# Altium project EtherWiz_3K4KNic.PrjPcb
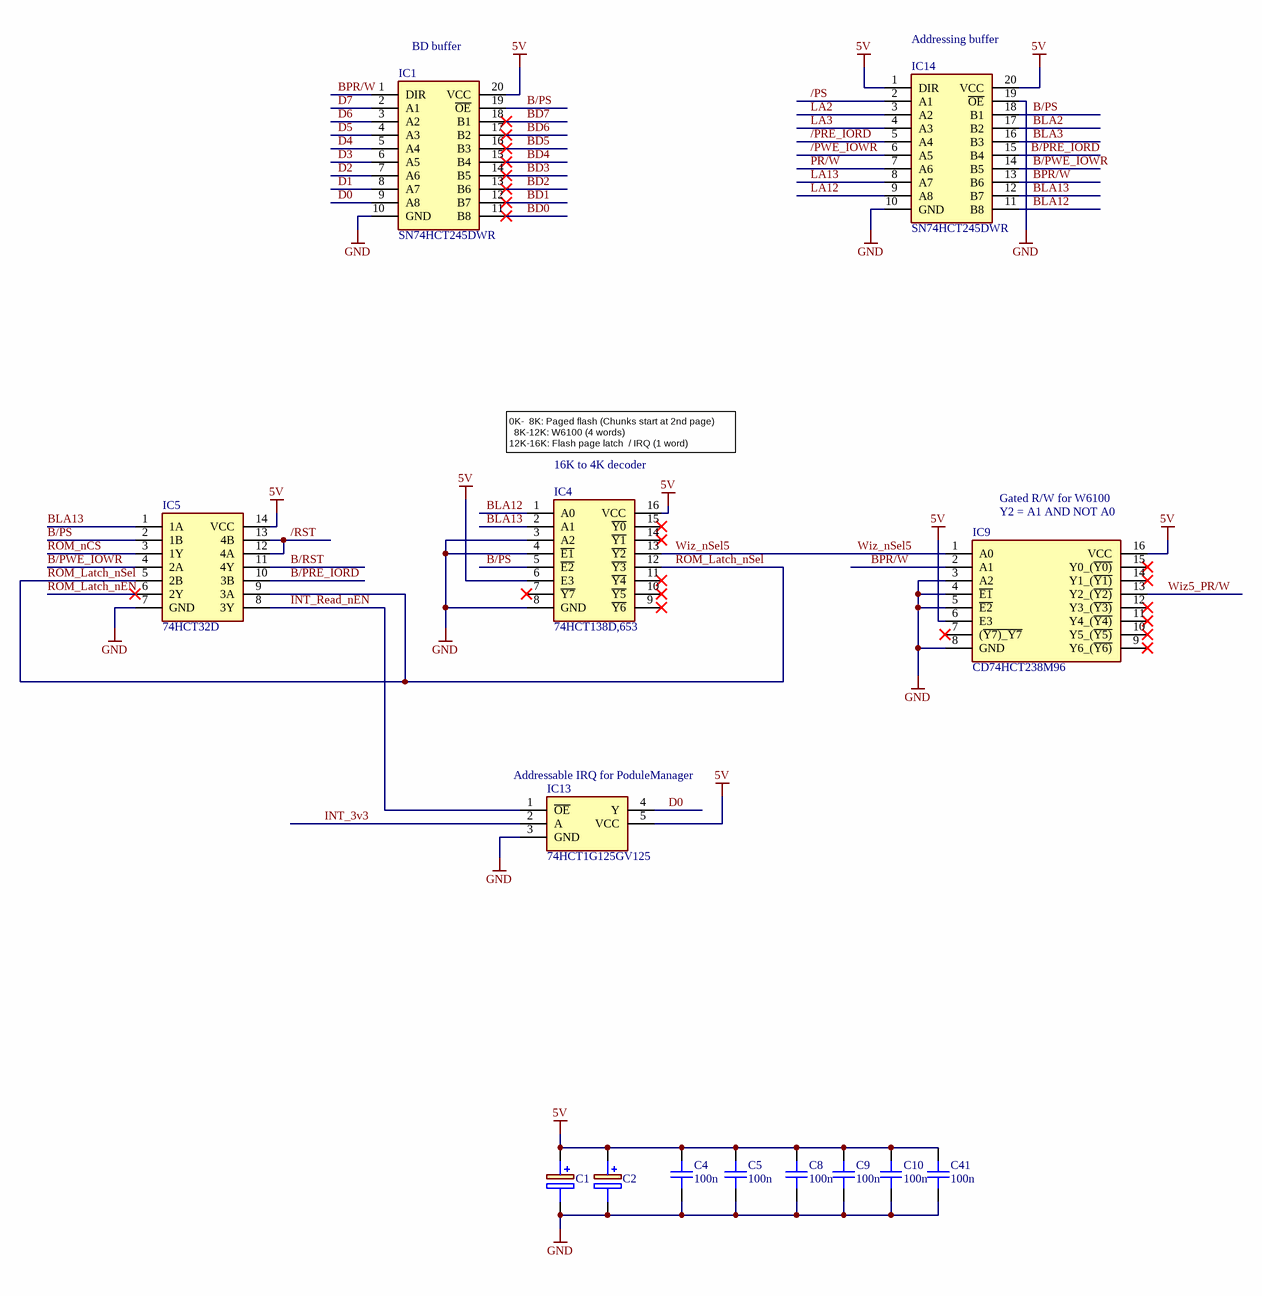
[diagram p0: EtherWiz.SchDoc]
DrawnBy: Ian Jeffray; PCB_RevNo: 1.1; Project_Title: EtherWiz; Sch_ReleaseDate: October 2026; Sch_RevNo: 7
4 sheets, 76 parts. Net scope: global (net labels, ports and power ports of the same name join across sheets).
Board file: EtherWiz_3K4KNic.PcbDoc
Sheets:
  EtherWiz.SchDoc
  EtherWiz_3K4KNic.SchDoc
  EtherWiz_Controller.SchDoc
  EtherWiz_ROM.SchDoc

## Sheet EtherWiz.SchDoc
size A3; SheetNumber: 1; SheetTotal: 3

### Parts
C1  EEE-HA1C470AP  [EEE1AA101SP]  (value not drawn)
C2  EEE-HA1C470AP  [EEE1AA101SP]  (value not drawn)
C4  100n  [CAPC1608L]
C5  100n  [CAPC1608L]
C8  100n  [CAPC1608L]
C9  100n  [CAPC1608L]
C10  100n  [CAPC1608L]
C41  100n  [CAPC1608L]
IC1  SN74HCT245DWR  [SOIC127P1030X265-20N]
IC4  74HCT138D,653  [SOIC127P600X175-16N]
IC5  74HCT32D  [SOIC127P600X175-14N]
IC9  CD74HCT238M96  [SOIC127P600X175-16N]
IC13  74HCT1G125GV125  [SOT95P275X110-5N]
IC14  SN74HCT245DWR  [SOIC127P1030X265-20N]

### Nets
5V: C1.1(+) C2.1(+) C4.2 C5.2 C8.2 C9.2 C10.2 C41.2 IC1.20(VCC) IC4.6(E3) IC4.16(VCC) IC5.14(VCC) IC9.6(E3) IC9.16(VCC) IC13.5(VCC) IC14.1(DIR) IC14.20(VCC)
GND: C1.2(-) C2.2(-) C4.1 C5.1 C8.1 C9.1 C10.1 C41.1 IC1.10(GND) IC4.3(A2) IC4.4(~{E1}) IC4.8(GND) IC5.7(GND) IC9.3(A2) IC9.4(~{E1}) IC9.5(~{E2}) IC9.8(GND) IC13.3(GND) IC14.10(GND) IC14.19(~{OE})
/PRE_IORD: IC14.5(A4)
/PS: IC14.2(A1)
/PWE_IOWR: IC14.6(A5)
/RST: IC5.12(4A) IC5.13(4B)
B/PRE_IORD: IC5.10(3B) IC14.15(B4)
B/PS: IC1.19(~{OE}) IC4.5(~{E2}) IC5.2(1B) IC14.18(B1)
B/PWE_IOWR: IC5.4(2A) IC14.14(B5)
B/RST: IC5.11(4Y)
BD0: IC1.11(B8)
BD1: IC1.12(B7)
BD2: IC1.13(B6)
BD3: IC1.14(B5)
BD4: IC1.15(B4)
BD5: IC1.16(B3)
BD6: IC1.17(B2)
BD7: IC1.18(B1)
BLA2: IC14.17(B2)
BLA3: IC14.16(B3)
BLA12: IC4.1(A0) IC14.11(B8)
BLA13: IC4.2(A1) IC5.1(1A) IC14.12(B7)
BPR/W: IC1.1(DIR) IC9.2(A1) IC14.13(B6)
D0: IC1.9(A8) IC13.4(Y)
D1: IC1.8(A7)
D2: IC1.7(A6)
D3: IC1.6(A5)
D4: IC1.5(A4)
D5: IC1.4(A3)
D6: IC1.3(A2)
D7: IC1.2(A1)
INT_3v3: IC13.2(A)
INT_Read_nEN: IC5.8(3Y) IC13.1(~{OE})
LA2: IC14.3(A2)
LA3: IC14.4(A3)
LA12: IC14.9(A8)
LA13: IC14.8(A7)
PR/W: IC14.7(A6)
ROM_Latch_nEN: IC5.6(2Y)
ROM_Latch_nSel: IC4.12(~{Y3}) IC5.5(2B) IC5.9(3A)
ROM_nCS: IC5.3(1Y)
Wiz5_PR/W: IC9.13(Y2_(~{Y2)})
Wiz_nSel5: IC4.13(~{Y2}) IC9.1(A0)

Not connected (* = marked no-connect by the designer): IC4 7(~{Y7})* 9(~{Y6})* 10(~{Y5})* 11(~{Y4})* 14(~{Y1})* 15(~{Y0})*; IC9 7((~{Y7)_Y7})* 9(Y6_(~{Y6)})* 10(Y5_(~{Y5)})* 11(Y4_(~{Y4)})* 12(Y3_(~{Y3)})* 14(Y1_(~{Y1)})* 15(Y0_(~{Y0)})*

### Notes on the sheet
- (near IC1) BD buffer
- (near IC14) Addressing buffer
- 0K-  8K: Paged flash (Chunks start at 2nd page)
  8K-12K: W6100 (4 words)
  12K-16K: Flash page latch  / IRQ (1 word)
- (near IC4) 16K to 4K decoder
- (near IC9) Gated R/W for W6100
- (near IC9) Y2 = A1 AND NOT A0
- (near IC13) Addressable IRQ for PoduleManager
- SIZE
- DIMENSIONS
- TITLE
- VARIANT
- REVISION
- DATE
- A3
- SHEET
- OF
- FILE
- DRAWN BY

### Library data of the parts
C1 C2 = EEE-HA1C470AP: Capacitor Polarised; Manufacturer_Name: Panasonic; Datasheet Link: http://industrial.panasonic.com/cdbs/www-data/pdf/RDE0000/ABA0000C1148.pdf; Height: 7.8mm; Manufacturer_Part_Number: EEE-HA1C470AP; Mouser Part Number: 667-EEE-HA1C470AP; Mouser Price/Stock: https://www.mouser.co.uk/ProductDetail/Panasonic/EEE-HA1C470AP?qs=d1CqaRUMZD%2FL5qU1hDRerg%3D%3D; Arrow Part Number: EEE-HA1C470AP; Arrow Price/Stock: https://www.arrow.com/en/products/eeeha1c470ap/panasonic?utm_currency=USD&region=europe
C4 C5 C8-C10 C41 = CAP_100n_0603_50V_0: CAP 100nF, 0603, 50V, X7R, 10%; Manufacturer1: Samsung; ManuPart1: CL10B104KB8NNNC; ManuPart2: CC0603KRX7R9BB104; Value: 100n; Distributor1: Anglia; Manufacturer2: Yageo; Distributor2: Digikey; Distributor1 Part No: CL10B104KB8NNNC; Distributor2 Part No: 311-1344-2-ND; ComponentLinknURL: *; ComponentLink1Description: ComponentLinknURL1; ComponentLink1URL: https://media.digikey.com/pdf/Data%20Sheets/Samsung%20PDFs/CL_Series_MLCC_ds.pdf; ComponentLink2Description: ComponentLinknURL2; ComponentLink2URL: https://www.yageo.com/upload/media/product/productsearch/datasheet/mlcc/UPY-GPHC_X7R_6.3V-to-50V_18.pdf; Voltage: 50V
IC1 IC14 = SN74HCT245DWR: Integrated Circuit; Manufacturer_Name: Texas Instruments; Datasheet Link: https://datasheet.datasheetarchive.com/originals/distributors/SFDatasheet-6/sf-000131457.pdf; Height: 2.65mm; Manufacturer_Part_Number: SN74HCT245DWR; Mouser Part Number: 595-SN74HCT245DWR; Mouser Price/Stock: https://www.mouser.co.uk/ProductDetail/Texas-Instruments/SN74HCT245DWR?qs=st7IWvlL5%2FhHLMwvvkYTgw%3D%3D; Arrow Part Number: SN74HCT245DWR; Arrow Price/Stock: https://www.arrow.com/en/products/sn74hct245dwr/texas-instruments?region=nac
IC4 = 74HCT138D,653: Integrated Circuit; Manufacturer_Name: Nexperia; Datasheet Link: https://assets.nexperia.com/documents/data-sheet/74HC_HCT138.pdf; Height: 1.75mm; Manufacturer_Part_Number: 74HCT138D,653; Mouser Part Number: 771-74HCT138D-T; Mouser Price/Stock: https://www.mouser.co.uk/ProductDetail/Nexperia/74HCT138D653?qs=P62ublwmbi8MKahyK7iY6g%3D%3D; Arrow Part Number: 74HCT138D,653; Arrow Price/Stock: https://www.arrow.com/en/products/74hct138d653/nexperia?region=nac
IC5 = 74HCT32D: Integrated Circuit; Manufacturer_Name: Toshiba; Datasheet Link: https://toshiba.semicon-storage.com/info/docget.jsp?did=37176&prodName=74HCT32D; Height: 1.75mm; Manufacturer_Part_Number: 74HCT32D; Mouser Part Number: N/A; Mouser Price/Stock: https://www.mouser.co.uk/ProductDetail/Toshiba/74HCT32D?qs=j%252B1pi9TdxUZqVZos7uP1Yw%3D%3D; Arrow Part Number: 74HCT32D; Arrow Price/Stock: https://www.arrow.com/en/products/74hct32d/toshiba?region=nac
IC9 = CD74HCT238M96: Integrated Circuit; Manufacturer_Name: Texas Instruments; Datasheet Link: http://www.ti.com/lit/gpn/cd74hct238; Height: 1.75mm; Manufacturer_Part_Number: CD74HCT238M96; Mouser Part Number: 595-CD74HCT238M96; Mouser Price/Stock: https://www.mouser.co.uk/ProductDetail/Texas-Instruments/CD74HCT238M96?qs=xFfolx0DHx1u%2Fks4%2FbIqqQ%3D%3D
IC13 = 74HCT1G125GV125: Integrated Circuit; Manufacturer_Name: Nexperia; Datasheet Link: https://assets.nexperia.com/documents/data-sheet/74HC_HCT1G125.pdf; Height: 1.1mm; Manufacturer_Part_Number: 74HCT1G125GV125

## Sheet EtherWiz_3K4KNic.SchDoc
size A3; SheetNumber: 2; SheetTotal: 3
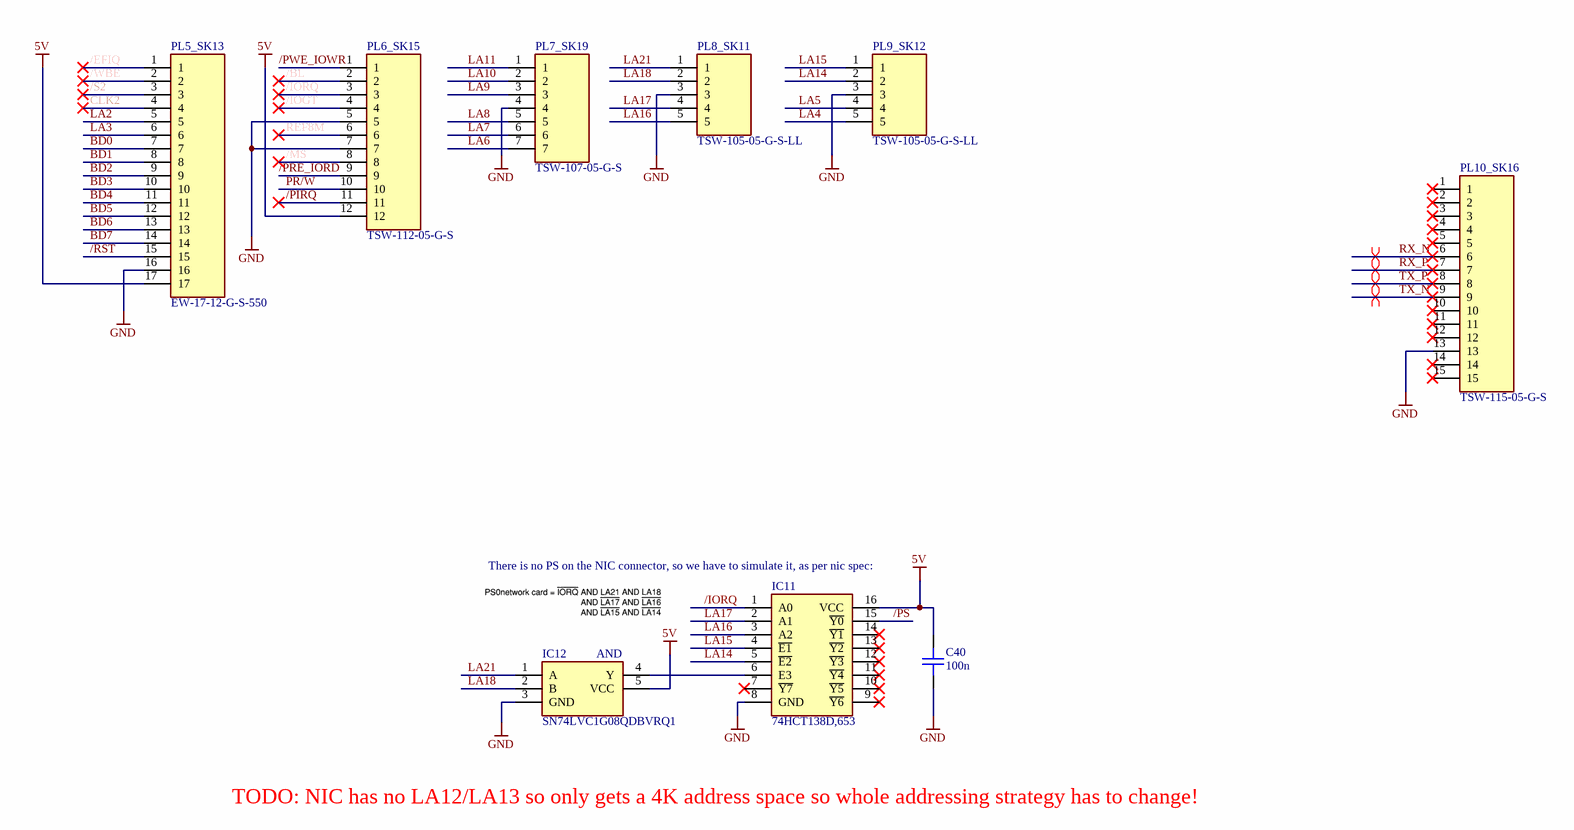
[diagram p1: EtherWiz_3K4KNic.SchDoc]

### Parts
C40  100n  [CAPC1608L]
IC11  74HCT138D,653  [SOIC127P600X175-16N]
IC12  SN74LVC1G08QDBVRQ1  [SOT95P280X145-5N]
PL5_SK13  EW-17-12-G-S-550  [TSW-117-XX-YY-S]
PL6_SK15  TSW-112-05-G-S  [TSW-112-XX-YY-S]
PL7_SK19  TSW-107-05-G-S  [TSW-107-XX-YY-S]
PL8_SK11  TSW-105-05-G-S-LL  [HDRV5W64P0X254_1X5_1270X254X521P]
PL9_SK12  TSW-105-05-G-S-LL  [HDRV5W64P0X254_1X5_1270X254X521P]
PL10_SK16  TSW-115-05-G-S  [TSW-115-XX-YY-S]

### Nets
5V: C40.2 IC11.16(VCC) IC12.5(VCC) PL5_SK13.17 PL6_SK15.12
GND: C40.1 IC11.8(GND) IC12.3(GND) PL5_SK13.16 PL6_SK15.5 PL6_SK15.7 PL7_SK19.4 PL8_SK11.3 PL9_SK12.3 PL10_SK16.13
/BL: PL6_SK15.2
/EFIQ: PL5_SK13.1
/IOGT: PL6_SK15.4
/IORQ: IC11.1(A0) PL6_SK15.3
/MS: PL6_SK15.8
/PIRQ: PL6_SK15.11
/PRE_IORD: PL6_SK15.9
/PS: IC11.15(~{Y0})
/PWE_IOWR: PL6_SK15.1
/RST: PL5_SK13.15
/S2: PL5_SK13.3
/WBE: PL5_SK13.2
BD0: PL5_SK13.7
BD1: PL5_SK13.8
BD2: PL5_SK13.9
BD3: PL5_SK13.10
BD4: PL5_SK13.11
BD5: PL5_SK13.12
BD6: PL5_SK13.13
BD7: PL5_SK13.14
CLK2: PL5_SK13.4
LA2: PL5_SK13.5
LA3: PL5_SK13.6
LA4: PL9_SK12.5
LA5: PL9_SK12.4
LA6: PL7_SK19.7
LA7: PL7_SK19.6
LA8: PL7_SK19.5
LA9: PL7_SK19.3
LA10: PL7_SK19.2
LA11: PL7_SK19.1
LA14: IC11.5(~{E2}) PL9_SK12.2
LA15: IC11.4(~{E1}) PL9_SK12.1
LA16: IC11.3(A2) PL8_SK11.5
LA17: IC11.2(A1) PL8_SK11.4
LA18: IC12.2(B) PL8_SK11.2
LA21: IC12.1(A) PL8_SK11.1
PR/W: PL6_SK15.10
REF8M: PL6_SK15.6
RX_N: PL10_SK16.6
RX_P: PL10_SK16.7
TX_N: PL10_SK16.9
TX_P: PL10_SK16.8
NetIC11_6: IC11.6(E3) IC12.4(Y)

Not connected (* = marked no-connect by the designer): IC11 7(~{Y7})* 9(~{Y6})* 10(~{Y5})* 11(~{Y4})* 12(~{Y3})* 13(~{Y2})* 14(~{Y1})*; PL10_SK16 1* 2* 3* 4* 5* 10* 11* 12* 14* 15*

### Layout directives
differential pair: RX_N, RX_P, TX_N, TX_P

### Notes on the sheet
- (near IC11) There is no PS on the NIC connector, so we have to simulate it, as per nic spec:
- (near IC12) AND
- TODO: NIC has no LA12/LA13 so only gets a 4K address space so whole addressing strategy has to change!
- SIZE
- DIMENSIONS
- TITLE
- VARIANT
- REVISION
- DATE
- A3
- SHEET
- OF
- FILE
- DRAWN BY

### Library data of the parts
C40 = CAP_100n_0603_50V_0: as C4 on sheet EtherWiz; Value: 100n; Distributor1: Anglia; Manufacturer2: Yageo; Distributor2: Digikey; Distributor1 Part No: CL10B104KB8NNNC; Distributor2 Part No: 311-1344-2-ND; ComponentLinknURL: *; ComponentLink1Description: ComponentLinknURL1; ComponentLink1URL: https://media.digikey.com/pdf/Data%20Sheets/Samsung%20PDFs/CL_Series_MLCC_ds.pdf; ComponentLink2Description: ComponentLinknURL2; ComponentLink2URL: https://www.yageo.com/upload/media/product/productsearch/datasheet/mlcc/UPY-GPHC_X7R_6.3V-to-50V_18.pdf; Voltage: 50V
IC11 = 74HCT138D,653: as IC4 on sheet EtherWiz; Datasheet Link: https://assets.nexperia.com/documents/data-sheet/74HC_HCT138.pdf; Height: 1.75mm; Manufacturer_Part_Number: 74HCT138D,653; Mouser Part Number: 771-74HCT138D-T; Mouser Price/Stock: https://www.mouser.co.uk/ProductDetail/Nexperia/74HCT138D653?qs=P62ublwmbi8MKahyK7iY6g%3D%3D; Arrow Part Number: 74HCT138D,653; Arrow Price/Stock: https://www.arrow.com/en/products/74hct138d653/nexperia?region=nac
IC12 = SN74LVC1G08QDBVRQ1: Integrated Circuit; Manufacturer_Name: Texas Instruments; Datasheet Link: http://www.ti.com/lit/ds/symlink/sn74lvc1g08-q1.pdf; Height: 1.45mm; Manufacturer_Part_Number: SN74LVC1G08QDBVRQ1; Mouser Part Number: 595-SN74LVC1G08QDBQ1; Mouser Price/Stock: https://www.mouser.co.uk/ProductDetail/Texas-Instruments/SN74LVC1G08QDBVRQ1?qs=PVVDbbWpW3K%252BPBrUmLG6eg%3D%3D; Arrow Part Number: SN74LVC1G08QDBVRQ1; Arrow Price/Stock: https://www.arrow.com/en/products/sn74lvc1g08qdbvrq1/texas-instruments?utm_currency=USD&region=nac
PL5_SK13 = TSW-117-05-G-S: Connector; Manufacturer_Name: SAMTEC; Datasheet Link: http://suddendocs.samtec.com/prints/tsw-xxx-xx-xxx-x-xx-xxx-mkt.pdf; Manufacturer_Part_Number: TSW-117-05-G-S
PL6_SK15 = TSW-112-05-G-S: Connector; Manufacturer_Name: SAMTEC; Datasheet Link: http://suddendocs.samtec.com/prints/tsw-xxx-xx-xxx-x-xx-xxx-mkt.pdf; Manufacturer_Part_Number: TSW-112-05-G-S
PL7_SK19 = TSW-107-05-G-S: Connector; Manufacturer_Name: SAMTEC; Datasheet Link: http://suddendocs.samtec.com/prints/tsw-xxx-xx-xxx-x-xx-xxx-mkt.pdf; Manufacturer_Part_Number: TSW-107-05-G-S
PL8_SK11 PL9_SK12 = TSW-105-05-G-S-LL: Connector; Manufacturer_Name: SAMTEC; Datasheet Link: https://componentsearchengine.com/Datasheets/2/TSW-105-05-G-S-LL.pdf; Height: 5.21mm; Manufacturer_Part_Number: TSW-105-05-G-S-LL
PL10_SK16 = TSW-115-05-G-S: Connector; Manufacturer_Name: SAMTEC; Datasheet Link: http://suddendocs.samtec.com/prints/tsw-xxx-xx-xxx-x-xx-xxx-mkt.pdf; Manufacturer_Part_Number: TSW-115-05-G-S

## Sheet EtherWiz_Controller.SchDoc
size A3; SheetNumber: 2; SheetTotal: 3
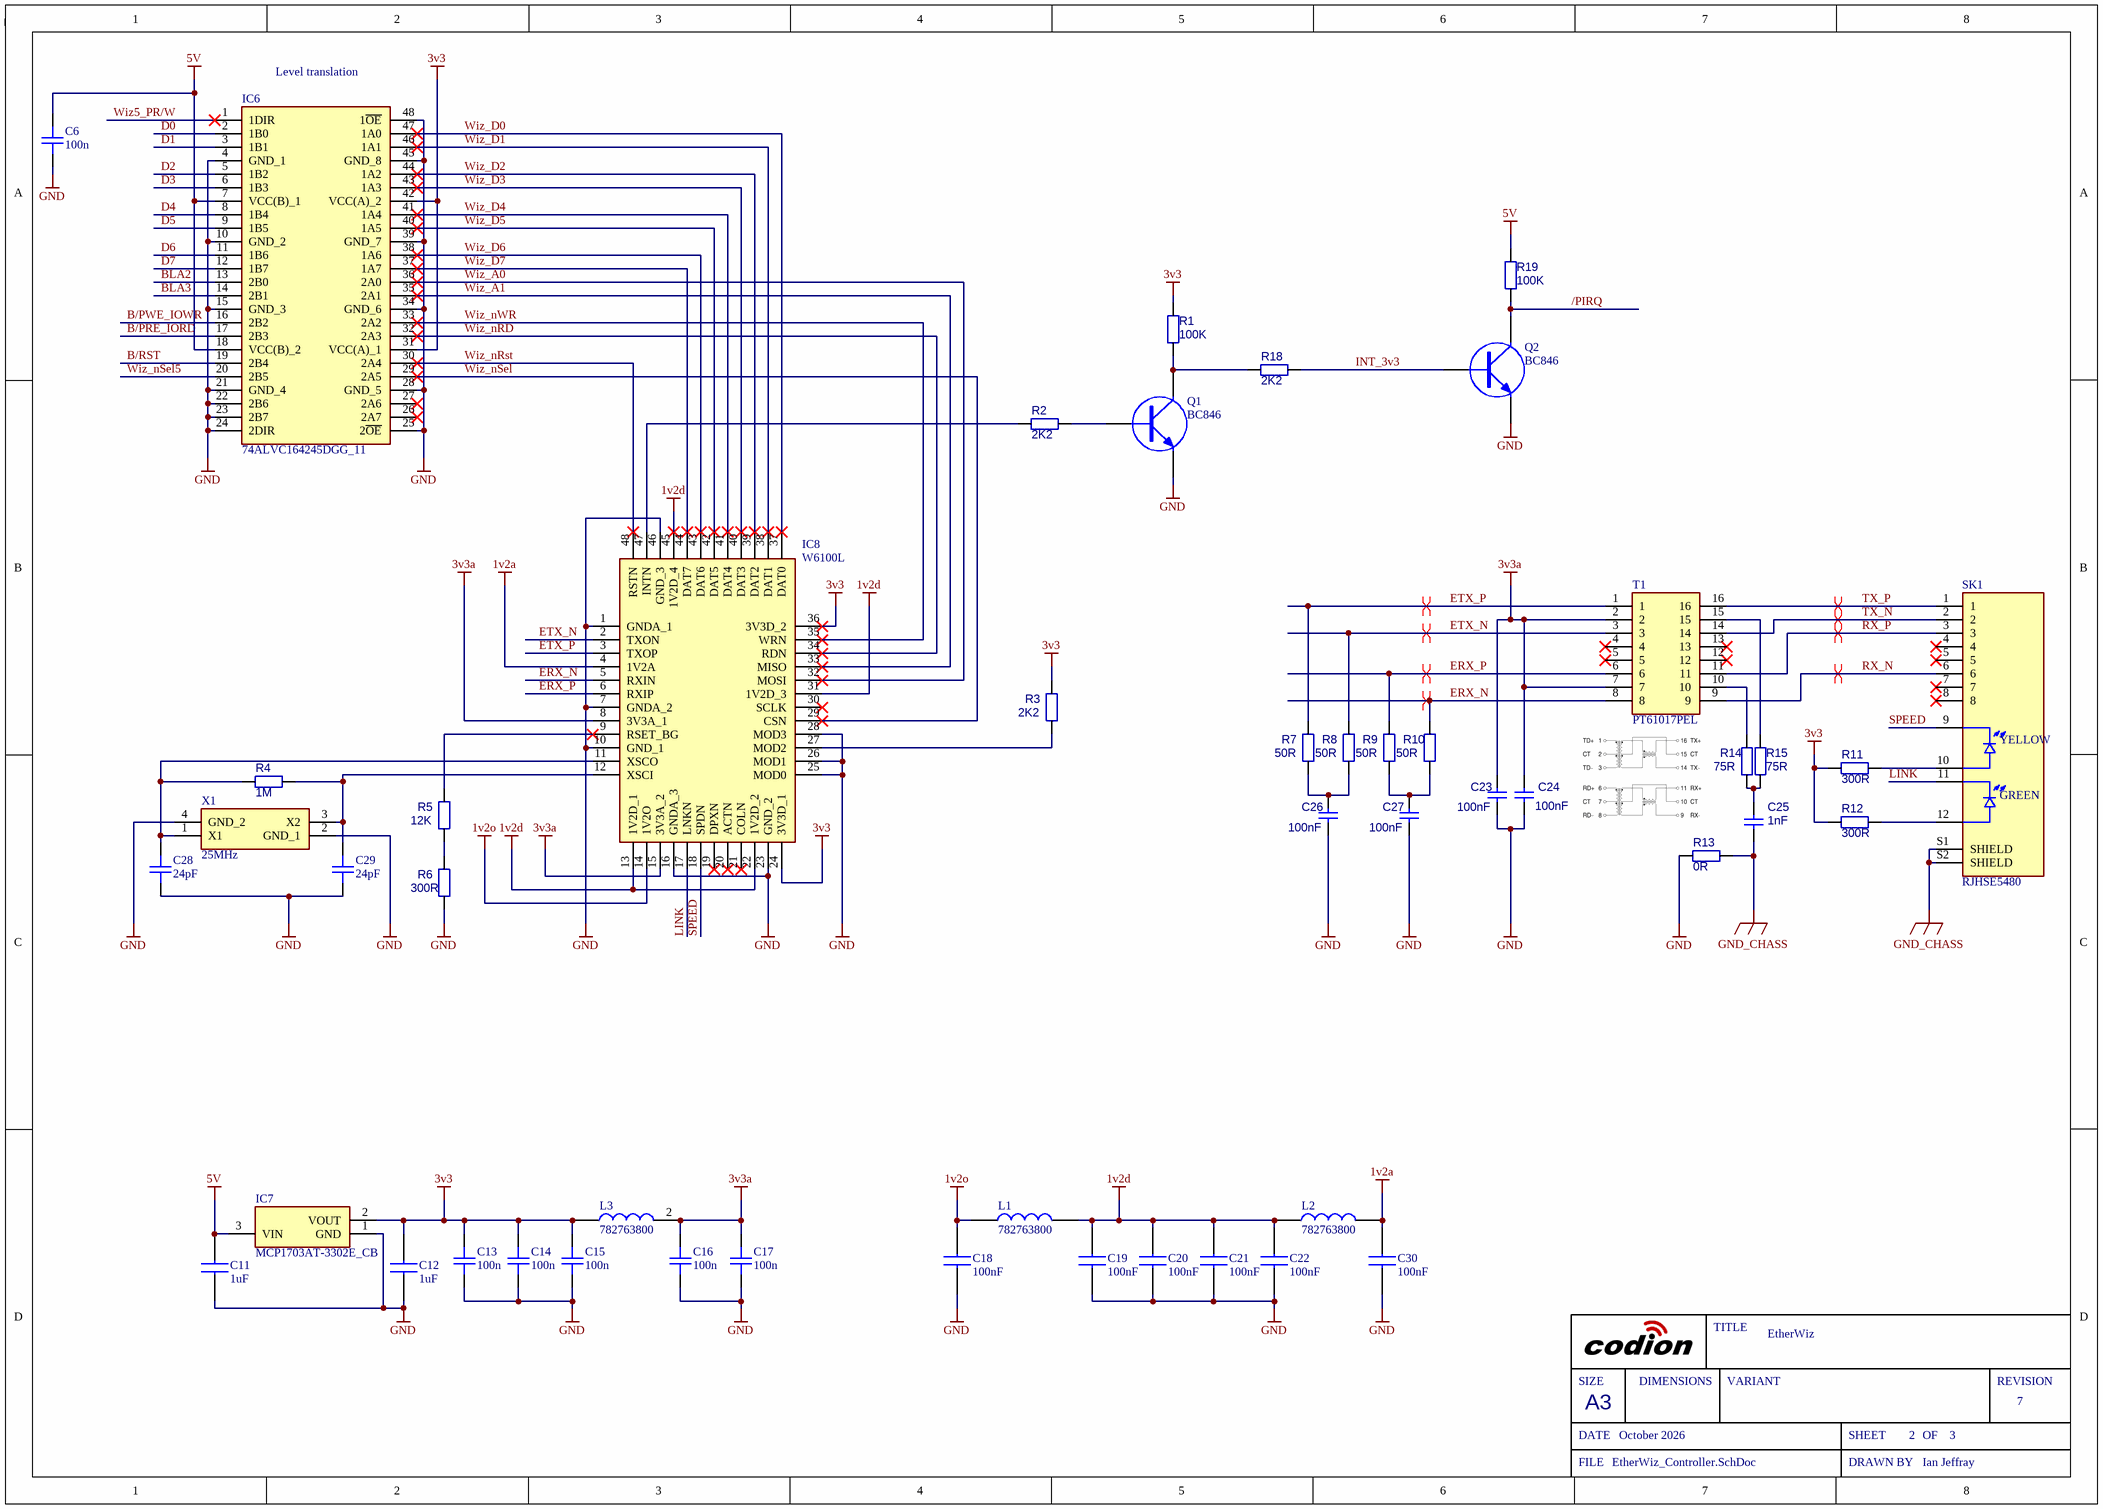
[diagram p2: EtherWiz_Controller.SchDoc]

### Parts
C6  100n  [CAPC1608L]
C11  1uF  [CAPC1608X90N]
C12  1uF  [CAPC1608X90N]
C13  100n  [CAPC1608L]
C14  100n  [CAPC1608L]
C15  100n  [CAPC1608L]
C16  100n  [CAPC1608L]
C17  100n  [CAPC1608L]
C18  100nF  [CAPC1608L]
C19  100nF  [CAPC1608L]
C20  100nF  [CAPC1608L]
C21  100nF  [CAPC1608L]
C22  100nF  [CAPC1608L]
C23  100nF  [CAPC1608L]
C24  100nF  [CAPC1608L]
C25  1nF  [CAPC1608L]
C26  100nF  [CAPC1608L]
C27  100nF  [CAPC1608L]
C28  24pF  [CAPC1608L]
C29  24pF  [CAPC1608L]
C30  100nF  [CAPC1608L]
IC6  74ALVC164245DGG_11  [SOP50P810X120-48N]
IC7  MCP1703AT-3302E_CB  [SOT95P255X145-3N]
IC8  W6100L  [QFP50P900X900X160-48N]
L1  782763800  [INDC3216X130N]
L2  782763800  [INDC3216X130N]
L3  782763800  [INDC3216X130N]
Q1  BC846  [SOT-23]
Q2  BC846  [SOT-23]
R1  100K  [RESC1608X50N]
R2  2K2  [RESC1608X50N]
R3  2K2  [RESC1608X50N]
R4  1M  [RESC1608X50N]
R5  12K  [RESC1608X50N]
R6  300R  [RESC1608X50N]
R7  50R  [RESC1608X50N]
R8  50R  [RESC1608X50N]
R9  50R  [RESC1608X50N]
R10  50R  [RESC1608X50N]
R11  300R  [RESC1608X50N]
R12  300R  [RESC1608X50N]
R13  0R  [RESC1608L]
R14  75R  [RESC1608L]
R15  75R  [RESC1608L]
R18  2K2  [RESC1608X50N]
R19  100K  [RESC1608X50N]
SK1  RJHSE5480  [AMPHENOL_RJHSE5480]
T1  PT61017PEL  [PT61017PEL]
X1  25MHz  [ABM810000MHZ12D2W]

### Nets
1v2a: C30.2 IC8.4(1V2A) L2.2
1v2d: C19.2 C20.2 C21.2 C22.2 IC8.13(1V2D_1) IC8.22(1V2D_2) IC8.31(1V2D_3) IC8.45(1V2D_4) L1.2 L2.1
1v2o: C18.2 IC8.14(1V2O) L1.1
3v3: C12.2 C13.2 C14.2 C15.2 IC6.31(VCC(A)_1) IC6.42(VCC(A)_2) IC7.2(VOUT) IC8.24(3V3D_1) IC8.36(3V3D_2) L3.1 R1.2 R3.2 R11.2 R12.2
3v3a: C16.2 C17.2 C23.2 C24.2 IC8.8(3V3A_1) IC8.15(3V3A_2) L3.2 T1.2 T1.7
5V: C6.2 C11.2 IC6.7(VCC(B)_1) IC6.18(VCC(B)_2) IC7.3(VIN) R19.2
GND: C6.1 C11.1 C12.1 C13.1 C14.1 C15.1 C16.1 C17.1 C18.1 C19.1 C20.1 C21.1 C22.1 C23.1 C24.1 C26.1 C27.1 C28.1 C29.1 C30.1 IC6.4(GND_1) IC6.10(GND_2) IC6.15(GND_3) IC6.21(GND_4) IC6.22(2B6) IC6.23(2B7) IC6.24(2DIR) IC6.25(2~{OE}) IC6.28(GND_5) IC6.34(GND_6) IC6.39(GND_7) IC6.45(GND_8) IC6.48(1~{OE}) IC7.1(GND) IC8.1(GNDA_1) IC8.7(GNDA_2) IC8.10(GND_1) IC8.16(GNDA_3) IC8.23(GND_2) IC8.25(MOD0) IC8.26(MOD1) IC8.28(MOD3) IC8.46(GND_3) Q1.2(E) Q2.2(E) R6.1 R13.1 X1.2(GND_1) X1.4(GND_2)
GND_CHASS: C25.1 R13.2 SK1.S1(SHIELD) SK1.S2(SHIELD)
/PIRQ: Q2.3(C) R19.1
B/PRE_IORD: IC6.17(2B3)
B/PWE_IOWR: IC6.16(2B2)
B/RST: IC6.19(2B4)
BLA2: IC6.13(2B0)
BLA3: IC6.14(2B1)
D0: IC6.2(1B0)
D1: IC6.3(1B1)
D2: IC6.5(1B2)
D3: IC6.6(1B3)
D4: IC6.8(1B4)
D5: IC6.9(1B5)
D6: IC6.11(1B6)
D7: IC6.12(1B7)
ERX_N: IC8.5(RXIN) R10.2 T1.8
ERX_P: IC8.6(RXIP) R9.2 T1.6
ETX_N: IC8.2(TXON) R8.2 T1.3
ETX_P: IC8.3(TXOP) R7.2 T1.1
INT_3v3: Q2.1(B) R18.2
LINK: IC8.17(LNKN) SK1.11
RX_N: SK1.6 T1.9
RX_P: SK1.3 T1.11
SPEED: IC8.18(SPDN) SK1.9
TX_N: SK1.2 T1.14
TX_P: SK1.1 T1.16
Wiz5_PR/W: IC6.1(1DIR)
Wiz_A0: IC6.36(2A0) IC8.32(MOSI)
Wiz_A1: IC6.35(2A1) IC8.33(MISO)
Wiz_D0: IC6.47(1A0) IC8.37(DAT0)
Wiz_D1: IC6.46(1A1) IC8.38(DAT1)
Wiz_D2: IC6.44(1A2) IC8.39(DAT2)
Wiz_D3: IC6.43(1A3) IC8.40(DAT3)
Wiz_D4: IC6.41(1A4) IC8.41(DAT4)
Wiz_D5: IC6.40(1A5) IC8.42(DAT5)
Wiz_D6: IC6.38(1A6) IC8.43(DAT6)
Wiz_D7: IC6.37(1A7) IC8.44(DAT7)
Wiz_nRD: IC6.32(2A3) IC8.34(RDN)
Wiz_nRst: IC6.30(2A4) IC8.48(RSTN)
Wiz_nSel: IC6.29(2A5) IC8.29(CSN)
Wiz_nSel5: IC6.20(2B5)
Wiz_nWR: IC6.33(2A2) IC8.35(WRN)
NetC25_2: C25.2 R14.1 R15.1
NetC26_2: C26.2 R7.1 R8.1
NetC27_2: C27.2 R9.1 R10.1
NetC28_2: C28.2 IC8.11(XSCO) R4.2 X1.1(X1)
NetC29_2: C29.2 IC8.12(XSCI) R4.1 X1.3(X2)
NetIC8_9: IC8.9(RSET_BG) R5.2
NetIC8_27: IC8.27(MOD2) R3.1
NetIC8_47: IC8.47(INTN) R2.1
NetQ1_1: Q1.1(B) R2.2
NetQ1_3: Q1.3(C) R1.1 R18.1
NetR5_1: R5.1 R6.2
NetR11_1: R11.1 SK1.10
NetR12_1: R12.1 SK1.12
NetR14_2: R14.2 T1.10
NetR15_2: R15.2 T1.15

Not connected (* = marked no-connect by the designer): IC6 26(2A7)* 27(2A6)*; IC8 19(DPXN)* 20(ACTN)* 21(COLN)* 30(SCLK)*; SK1 4* 5* 7* 8*; T1 4* 5* 12* 13*

### Layout directives
differential pair: ERX_N, ERX_P, ETX_N, ETX_P, RX_N, RX_P, TX_N, TX_P

### Notes on the sheet
- (near IC6) Level translation
- SIZE
- DIMENSIONS
- TITLE
- VARIANT
- REVISION
- DATE
- A3
- SHEET
- OF
- FILE
- DRAWN BY
- (in symbol RJHSE5480) YELLOW; GREEN

### Library data of the parts
C6 C13-C17 = CAP_100n_0603_50V_0: as C4 on sheet EtherWiz; Value: 100n; Distributor1: Anglia; Manufacturer2: Yageo; Distributor2: Digikey; Distributor1 Part No: CL10B104KB8NNNC; Distributor2 Part No: 311-1344-2-ND; ComponentLinknURL: *; ComponentLink1Description: ComponentLinknURL1; ComponentLink1URL: https://media.digikey.com/pdf/Data%20Sheets/Samsung%20PDFs/CL_Series_MLCC_ds.pdf; ComponentLink2Description: ComponentLinknURL2; ComponentLink2URL: https://www.yageo.com/upload/media/product/productsearch/datasheet/mlcc/UPY-GPHC_X7R_6.3V-to-50V_18.pdf; Voltage: 50V
C11 C12 = CL10A105KP8NNNC: Capacitor; Manufacturer_Name: SAMSUNG; Datasheet Link: https://datasheet.lcsc.com/szlcsc/Samsung-Electro-Mechanics-CL10A105KP8NNNC_C26413.pdf; Height: 0.9mm; Manufacturer_Part_Number: CL10A105KP8NNNC; Mouser Part Number: 187-CL10A105KP8NNNC; Mouser Price/Stock: https://www.mouser.co.uk/ProductDetail/Samsung-Electro-Mechanics/CL10A105KP8NNNC?qs=349EhDEZ59qtu6tL%2F73n2A%3D%3D; Arrow Part Number: CL10A105KP8NNNC; Arrow Price/Stock: https://www.arrow.com/en/products/cl10a105kp8nnnc/samsung-electro-mechanics?utm_currency=USD&region=nac
C18-C22 C30 = 100nF0805: Capacitor; Manufacturer_Name: TDK; Manufacturer_Part_Number: C2012X7R1H104K125AM; Datasheet Link: https://product.tdk.com/info/en/catalog/datasheets/mlcc_commercial_midvoltage_en.pdf; Height: 1.45mm; Mouser Part Number: 810-C2012X7R1H104KT5; Mouser Price/Stock: https://www.mouser.com/Search/Refine.aspx?Keyword=810-C2012X7R1H104KT5; Arrow Part Number: C2012X7R1H104K125AM; Arrow Price/Stock: https://www.arrow.com/en/products/c2012x7r1h104k125am/tdk; LCSC Part #: C111492
C23 C24 C26 C27 = 909-0001-L: Cap ceramic X7R/X5R 100nF 10% 16V C0603; Manufacturer: EPCOS; ManuPart: B37931-K9104-K60; Qualified2ndPart: CC0603KRX7R7BB104; Disti Part Number: 432-210; Tolerance: 0.1; Qualified2ndManu: Yageo; Cost(£): 0.038; Value: 100nF; Construction: X7R; Voltage: 16V; Simulation: CAP; Distributer: Farnell; RoHS Compliant: YES; Component Type: Standard; LCSC Part #: C66501
C25 = 910-0053-L: Cap ceramic X7R 1nF 10% 2kV C1206; Manufacturer: AVX; ManuPart: 1206GC102KAT1A; Tolerance: 0.1; Voltage: 2000V; Cost(£): 0.187; Value: 1nF; Construction: X7R; Simulation: CAP; Distributer: Anglia; Disti Part Number: 1206GC102KAT1A; RoHS Compliant: YES; Component Type: Standard; LCSC Part #: C23631
C28 C29 = CAP_10P_0603_50V_0: CAP 10PF, 0603, 50V, NP0, 10%; Value: 24pF; ComponentLinknURL: *
IC6 = 74ALVC164245DGG_11: Integrated Circuit; Manufacturer_Name: Nexperia; Manufacturer_Part_Number: 74ALVC164245DGG:11; Datasheet Link: https://assets.nexperia.com/documents/data-sheet/74ALVC164245.pdf; Height: 1.2mm; Mouser Part Number: 771-74ALVC164245; Mouser Price/Stock: https://www.mouser.co.uk/ProductDetail/Nexperia/74ALVC164245DGG11?qs=odJ8N4Y39o4j0ykFPcnqaQ%3D%3D; Arrow Part Number: 74ALVC164245DGG:11; Arrow Price/Stock: https://www.arrow.com/en/products/74alvc164245dgg11/nexperia?utm_currency=USD&region=nac
IC7 = MCP1703AT-3302E_CB: Integrated Circuit; Manufacturer_Name: Microchip; Manufacturer_Part_Number: MCP1703AT-3302E/CB; Datasheet Link: http://uk.rs-online.com/web/p/products/7709509; Height: 1.45mm; Mouser Part Number: 579-MCP1703AT3302ECB; Mouser Price/Stock: https://www.mouser.co.uk/ProductDetail/Microchip-Technology/MCP1703AT-3302E-CB?qs=PZkJWYMe7leeY97bgTp%252B9w%3D%3D; Arrow Part Number: MCP1703AT-3302E/CB; Arrow Price/Stock: https://www.arrow.com/en/products/mcp1703at-3302ecb/microchip-technology?region=nac
IC8 = W6100L: Integrated Circuit; Manufacturer_Name: WIZnet Inc; Datasheet Link: https://eu.mouser.com/datasheet/2/443/w6100_ds_v104e-1994614.pdf; Height: 1.6mm; Manufacturer_Part_Number: W6100L; Mouser Part Number: 950-W6100L; Mouser Price/Stock: https://www.mouser.co.uk/ProductDetail/WIZnet/W6100L?qs=pUKx8fyJudARLmbJE2EKlA%3D%3D
L1-L3 = 74279215: Inductor; Manufacturer_Name: Wurth Elektronik; Datasheet Link: http://componentsearchengine.com/Datasheets/1/74279215.pdf; Height: 1.3mm; Manufacturer_Part_Number: 782763800; Mouser Part Number: 710-782763800; Mouser Price/Stock: https://www.mouser.co.uk/ProductDetail/Wurth-Elektronik/74279215?qs=5twSNpOB8IC%252BebnV0jQtuw%3D%3D
Q1 Q2 = TRANS_NPN_BC846_0: Transistor NPN, 65V, 100mA, TO-236AB/SOT23; Value: BC846; ComponentLinknURL: *
R1 R19 = 920-0030-L: Resistor 100K 1%  0603; Value: 100K
R2 R3 R18 = 920-0030-L: Resistor 2K2 1%  0603; Manufacturer: Multicomp; ManuPart: MCWR06X75R0FTL; Disti Part Number: 2447434; Tolerance: 0.01; Power: 63mW; Cost(£): 0.025; Value: 2K2; Construction: Thick Film; Simulation: RES; Distributer: Farnell; RoHS Compliant: YES; Component Type: Standard; LCSC Part #: C127449
R4 = 920-0030-L: Resistor 1M 1%  0603; Manufacturer: Multicomp; ManuPart: MCWR06X75R0FTL; Disti Part Number: 2447434; Tolerance: 0.01; Power: 63mW; Cost(£): 0.025; Value: 1M; Construction: Thick Film; Simulation: RES; Distributer: Farnell; RoHS Compliant: YES; Component Type: Standard; LCSC Part #: C127449
R5 = 920-0030-L: Resistor 12K 1%  0603; Manufacturer: Multicomp; ManuPart: MCWR06X75R0FTL; Disti Part Number: 2447434; Tolerance: 0.01; Power: 63mW; Cost(£): 0.025; Value: 12K; Construction: Thick Film; Simulation: RES; Distributer: Farnell; RoHS Compliant: YES; Component Type: Standard; LCSC Part #: C127449
R6 = 920-0030-L: Resistor 300R 1%  0603; Manufacturer: Multicomp; ManuPart: MCWR06X75R0FTL; Disti Part Number: 2447434; Tolerance: 0.01; Power: 63mW; Cost(£): 0.025; Value: 300R; Construction: Thick Film; Simulation: RES; Distributer: Farnell; RoHS Compliant: YES; Component Type: Standard; LCSC Part #: C127449
R7-R10 = 920-0030-L: Resistor 50R 1%  0603; Manufacturer: Multicomp; ManuPart: MCWR06X75R0FTL; Disti Part Number: 2447434; Tolerance: 0.01; Power: 63mW; Cost(£): 0.025; Value: 50R; Construction: Thick Film; Simulation: RES; Distributer: Farnell; RoHS Compliant: YES; Component Type: Standard; LCSC Part #: C127449
R11 R12 = 920-0030-L: Resistor 300R 1%  0603; Value: 300R
R13 = 920-0001-L: Resistor 0R0 1A Max 0603; Manufacturer: Vishay; ManuPart: CRCW06030000Z0EA; Qualified2ndPart: RC0603JR-070RL; Disti Part Number: 923-3130; Qualified2ndManu: Yageo; Cost(£): 0.056; Value: 0R; Construction: Thick Film; Simulation: RES; Distributer: Farnell; RoHS Compliant: YES; Component Type: Standard; LCSC Part #: C844718
R14 R15 = 920-0030-L: Resistor 75R 1%  0603; Manufacturer: Multicomp; ManuPart: MCWR06X75R0FTL; Disti Part Number: 2447434; Tolerance: 0.01; Power: 63mW; Cost(£): 0.025; Value: 75R; Construction: Thick Film; Simulation: RES; Distributer: Farnell; RoHS Compliant: YES; Component Type: Standard; LCSC Part #: C127449
SK1 = RJHSE5480: Ethernet socket - through hole; Manufacturer: Amphenol; Disti Part Number: 2709018; ManuPart: RJHSE-5480; Value: *; Distributer: Farnell
T1 = PT61017PEL: Transformer; Manufacturer: Bourns; Disti Part Number: 652-PT61017PEL; Datasheet Link: http://www.bourns.com/docs/Product-Datasheets/pt61017pel.pdf; Height: 5mm; ManuPart: PT61017PEL; Mouser Price/Stock: https://www.mouser.co.uk/ProductDetail/Bourns/PT61017PEL?qs=0rbOLB9uh%252BASY8PB9lbWrQ%3D%3D; Distributer: Mouser; Arrow Price/Stock: https://www.arrow.com/en/products/pt61017pel/bourns?region=europe; LCSC Part #: C124001
X1 = ABM8-25.000MHZ-D2X-T: Crystal or Oscillator; Manufacturer_Name: ABRACON; Datasheet Link: https://abracon.com/Resonators/abm8.pdf; Height: 0.8mm; Manufacturer_Part_Number: ABM8-25.000MHZ-D2X-T; Mouser Part Number: 815-ABM825MHZD2XT; Mouser Price/Stock: https://www.mouser.co.uk/ProductDetail/ABRACON/ABM8-25.000MHZ-D2X-T?qs=XeJtXLiO41RuPiM7CXbPRQ%3D%3D; Arrow Part Number: ABM8-25.000MHZ-D2X-T; Arrow Price/Stock: https://www.arrow.com/en/products/abm8-25.000mhz-d2x-t/abracon?region=nac

## Sheet EtherWiz_ROM.SchDoc
size A3; SheetNumber: 4; SheetTotal: 4
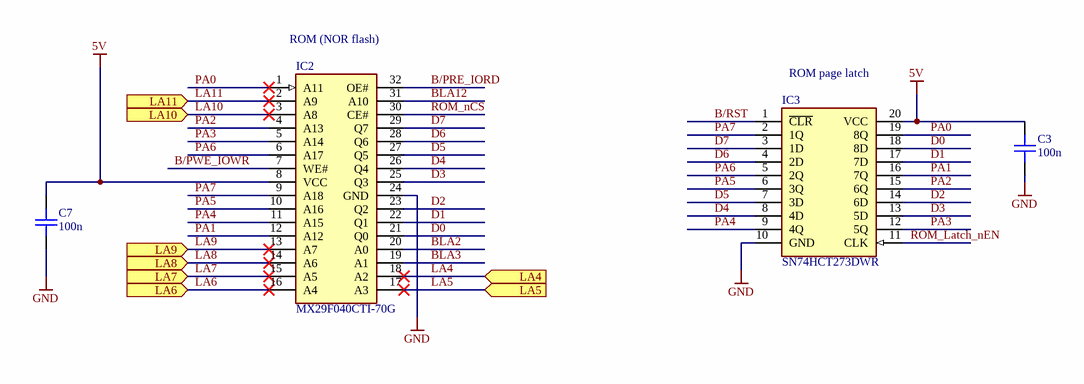
[diagram p3: EtherWiz_ROM.SchDoc]

### Parts
C3  100n  [CAPC1608L]
C7  100n  [CAPC1608L]
IC2  MX29F040CTI-70G  [SOP50P2000X120-32N]
IC3  SN74HCT273DWR  [SOIC127P1030X265-20N]

### Ports
LA4 (in, see EtherWiz_Mini[4B]), LA5 (in, see EtherWiz_Mini[4B]), LA6 (in, see EtherWiz_Mini[4B]), LA7 (in, see EtherWiz_Mini[4B]), LA8 (in, see EtherWiz_Mini[4B]), LA9 (in, see EtherWiz_Mini[4B]), LA10 (in, see EtherWiz_Mini[4B]), LA11 (in, see EtherWiz_Mini[4B])

### Nets
5V: C3.2 C7.2 IC2.8(VCC) IC3.20(VCC)
GND: C3.1 C7.1 IC2.24(GND) IC3.10(GND)
B/PRE_IORD: IC2.32(OE#)
B/PWE_IOWR: IC2.7(WE#)
B/RST: IC3.1(~{CLR})
BLA2: IC2.20(A0)
BLA3: IC2.19(A1)
BLA12: IC2.31(A10)
D0: IC2.21(Q0) IC3.18(8D)
D1: IC2.22(Q1) IC3.17(7D)
D2: IC2.23(Q2) IC3.14(6D)
D3: IC2.25(Q3) IC3.13(5D)
D4: IC2.26(Q4) IC3.8(4D)
D5: IC2.27(Q5) IC3.7(3D)
D6: IC2.28(Q6) IC3.4(2D)
D7: IC2.29(Q7) IC3.3(1D)
LA4: IC2.18(A2) ; port LA4
LA5: IC2.17(A3) ; port LA5
LA6: IC2.16(A4) ; port LA6
LA7: IC2.15(A5) ; port LA7
LA8: IC2.14(A6) ; port LA8
LA9: IC2.13(A7) ; port LA9
LA10: IC2.3(A8) ; port LA10
LA11: IC2.2(A9) ; port LA11
PA0: IC2.1(A11) IC3.19(8Q)
PA1: IC2.12(A12) IC3.16(7Q)
PA2: IC2.4(A13) IC3.15(6Q)
PA3: IC2.5(A14) IC3.12(5Q)
PA4: IC2.11(A15) IC3.9(4Q)
PA5: IC2.10(A16) IC3.6(3Q)
PA6: IC2.6(A17) IC3.5(2Q)
PA7: IC2.9(A18) IC3.2(1Q)
ROM_Latch_nEN: IC3.11(CLK)
ROM_nCS: IC2.30(CE#)

### Notes on the sheet
- (near IC2) ROM (NOR flash)
- (near IC3) ROM page latch
- SIZE
- DIMENSIONS
- TITLE
- VARIANT
- REVISION
- DATE
- A3
- SHEET
- OF
- FILE
- DRAWN BY

### Library data of the parts
C3 C7 = CAP_100n_0603_50V_0: as C4 on sheet EtherWiz; Value: 100n; Distributor1: Anglia; Manufacturer2: Yageo; Distributor2: Digikey; Distributor1 Part No: CL10B104KB8NNNC; Distributor2 Part No: 311-1344-2-ND; ComponentLinknURL: *; ComponentLink1Description: ComponentLinknURL1; ComponentLink1URL: https://media.digikey.com/pdf/Data%20Sheets/Samsung%20PDFs/CL_Series_MLCC_ds.pdf; ComponentLink2Description: ComponentLinknURL2; ComponentLink2URL: https://www.yageo.com/upload/media/product/productsearch/datasheet/mlcc/UPY-GPHC_X7R_6.3V-to-50V_18.pdf; Voltage: 50V
IC2 = MX29F040CTI-70G: Integrated Circuit; Manufacturer_Name: Macronix; Datasheet Link: https://www.macronix.com/Lists/Datasheet/Attachments/7266/MX29F040C,%205V,%204Mb,%20v2.2.pdf; Height: 1.2mm; Manufacturer_Part_Number: MX29F040CTI-70G; Arrow Part Number: MX29F040CTI-70G; Arrow Price/Stock: https://www.arrow.com/en/products/mx29f040cti-70g/macronix-international?region=nac
IC3 = SN74HCT273DWR: Integrated Circuit; Manufacturer_Name: Texas Instruments; Datasheet Link: https://datasheet.datasheetarchive.com/originals/distributors/Datasheets-36/DSA-718641.pdf; Height: 2.65mm; Manufacturer_Part_Number: SN74HCT273DWR; Mouser Part Number: 595-SN74HCT273DWR; Mouser Price/Stock: https://www.mouser.co.uk/ProductDetail/Texas-Instruments/SN74HCT273DWR?qs=SL3LIuy2dWww%2FZr6up0MdA%3D%3D; Arrow Part Number: SN74HCT273DWR; Arrow Price/Stock: https://www.arrow.com/en/products/sn74hct273dwr/texas-instruments

## Nets that join several sheets
5V: EtherWiz (17 pins), EtherWiz_3K4KNic (5 pins), EtherWiz_Controller (6 pins), EtherWiz_ROM (C3.2 C7.2 IC2.8 IC3.20)
GND: EtherWiz (20 pins), EtherWiz_3K4KNic (10 pins), EtherWiz_Controller (49 pins), EtherWiz_ROM (C3.1 C7.1 IC2.24 IC3.10)
/PIRQ: EtherWiz_3K4KNic (PL6_SK15.11), EtherWiz_Controller (Q2.3 R19.1)
/PRE_IORD: EtherWiz (IC14.5), EtherWiz_3K4KNic (PL6_SK15.9)
/PS: EtherWiz (IC14.2), EtherWiz_3K4KNic (IC11.15)
/PWE_IOWR: EtherWiz (IC14.6), EtherWiz_3K4KNic (PL6_SK15.1)
/RST: EtherWiz (IC5.12 IC5.13), EtherWiz_3K4KNic (PL5_SK13.15)
B/PRE_IORD: EtherWiz (IC5.10 IC14.15), EtherWiz_Controller (IC6.17), EtherWiz_ROM (IC2.32)
B/PWE_IOWR: EtherWiz (IC5.4 IC14.14), EtherWiz_Controller (IC6.16), EtherWiz_ROM (IC2.7)
B/RST: EtherWiz (IC5.11), EtherWiz_Controller (IC6.19), EtherWiz_ROM (IC3.1)
BD0: EtherWiz (IC1.11), EtherWiz_3K4KNic (PL5_SK13.7)
BD1: EtherWiz (IC1.12), EtherWiz_3K4KNic (PL5_SK13.8)
BD2: EtherWiz (IC1.13), EtherWiz_3K4KNic (PL5_SK13.9)
BD3: EtherWiz (IC1.14), EtherWiz_3K4KNic (PL5_SK13.10)
BD4: EtherWiz (IC1.15), EtherWiz_3K4KNic (PL5_SK13.11)
BD5: EtherWiz (IC1.16), EtherWiz_3K4KNic (PL5_SK13.12)
BD6: EtherWiz (IC1.17), EtherWiz_3K4KNic (PL5_SK13.13)
BD7: EtherWiz (IC1.18), EtherWiz_3K4KNic (PL5_SK13.14)
BLA2: EtherWiz (IC14.17), EtherWiz_Controller (IC6.13), EtherWiz_ROM (IC2.20)
BLA3: EtherWiz (IC14.16), EtherWiz_Controller (IC6.14), EtherWiz_ROM (IC2.19)
BLA12: EtherWiz (IC4.1 IC14.11), EtherWiz_ROM (IC2.31)
D0: EtherWiz (IC1.9 IC13.4), EtherWiz_Controller (IC6.2), EtherWiz_ROM (IC2.21 IC3.18)
D1: EtherWiz (IC1.8), EtherWiz_Controller (IC6.3), EtherWiz_ROM (IC2.22 IC3.17)
D2: EtherWiz (IC1.7), EtherWiz_Controller (IC6.5), EtherWiz_ROM (IC2.23 IC3.14)
D3: EtherWiz (IC1.6), EtherWiz_Controller (IC6.6), EtherWiz_ROM (IC2.25 IC3.13)
D4: EtherWiz (IC1.5), EtherWiz_Controller (IC6.8), EtherWiz_ROM (IC2.26 IC3.8)
D5: EtherWiz (IC1.4), EtherWiz_Controller (IC6.9), EtherWiz_ROM (IC2.27 IC3.7)
D6: EtherWiz (IC1.3), EtherWiz_Controller (IC6.11), EtherWiz_ROM (IC2.28 IC3.4)
D7: EtherWiz (IC1.2), EtherWiz_Controller (IC6.12), EtherWiz_ROM (IC2.29 IC3.3)
INT_3v3: EtherWiz (IC13.2), EtherWiz_Controller (Q2.1 R18.2)
LA2: EtherWiz (IC14.3), EtherWiz_3K4KNic (PL5_SK13.5)
LA3: EtherWiz (IC14.4), EtherWiz_3K4KNic (PL5_SK13.6)
LA4: EtherWiz_3K4KNic (PL9_SK12.5), EtherWiz_ROM (IC2.18)
LA5: EtherWiz_3K4KNic (PL9_SK12.4), EtherWiz_ROM (IC2.17)
LA6: EtherWiz_3K4KNic (PL7_SK19.7), EtherWiz_ROM (IC2.16)
LA7: EtherWiz_3K4KNic (PL7_SK19.6), EtherWiz_ROM (IC2.15)
LA8: EtherWiz_3K4KNic (PL7_SK19.5), EtherWiz_ROM (IC2.14)
LA9: EtherWiz_3K4KNic (PL7_SK19.3), EtherWiz_ROM (IC2.13)
LA10: EtherWiz_3K4KNic (PL7_SK19.2), EtherWiz_ROM (IC2.3)
LA11: EtherWiz_3K4KNic (PL7_SK19.1), EtherWiz_ROM (IC2.2)
PR/W: EtherWiz (IC14.7), EtherWiz_3K4KNic (PL6_SK15.10)
ROM_Latch_nEN: EtherWiz (IC5.6), EtherWiz_ROM (IC3.11)
ROM_nCS: EtherWiz (IC5.3), EtherWiz_ROM (IC2.30)
RX_N: EtherWiz_3K4KNic (PL10_SK16.6), EtherWiz_Controller (SK1.6 T1.9)
RX_P: EtherWiz_3K4KNic (PL10_SK16.7), EtherWiz_Controller (SK1.3 T1.11)
TX_N: EtherWiz_3K4KNic (PL10_SK16.9), EtherWiz_Controller (SK1.2 T1.14)
TX_P: EtherWiz_3K4KNic (PL10_SK16.8), EtherWiz_Controller (SK1.1 T1.16)
Wiz5_PR/W: EtherWiz (IC9.13), EtherWiz_Controller (IC6.1)
Wiz_nSel5: EtherWiz (IC4.13 IC9.1), EtherWiz_Controller (IC6.20)

## Assembly variants
Full Podule: not fitted C40 IC11 IC12 PL5_SK13 PL6_SK15 PL7_SK19 PL8_SK11 PL9_SK12 PL10_SK16
Mini Podule: not fitted C40 IC11 IC12 PL5_SK13 PL6_SK15 PL7_SK19 PL8_SK11 PL9_SK12 PL10_SK16
A4: not fitted C1 C2 C4 C5 C8 C9 C40 C41 IC1 IC4 IC5 IC9 IC11 IC12 IC13 IC14 PL5_SK13 PL6_SK15 PL7_SK19 PL8_SK11 PL9_SK12 PL10_SK16 R11 R12 SK1
A3020_A4000: not fitted R11 R12 SK1
RiscPC_A7000: not fitted C40 IC11 IC12 PL5_SK13 PL6_SK15 PL7_SK19 PL8_SK11 PL9_SK12 PL10_SK16